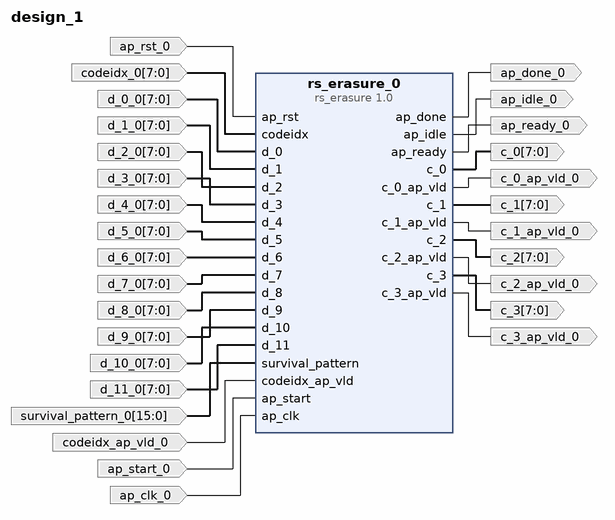
[diagram p0: block diagram of the top level]
# Vivado block design design_1, xc7a35tcpg236-1, Vivado 2018.1
create_bd_design design_1

create_bd_port -dir I -type rst ap_rst_0
set_property -dict {CONFIG.POLARITY ACTIVE_HIGH} [get_bd_ports ap_rst_0]
create_bd_port -dir I -from 7 -to 0 -type data codeidx_0
set_property -dict [list \
  CONFIG.LAYERED_METADATA {xilinx.com:interface:datatypes:1.0 {DATA {datatype {name {attribs {resolve_type immediate dependency {} format string minimum {} maximum {}} value {}} bitwidth {attribs {resolve_type immediate dependency {} format long minimum {} maximum {}} value 8} bitoffset {attribs {resolve_type immediate dependency {} format long minimum {} maximum {}} value 0} integer {signed {attribs {resolve_type immediate dependency {} format bool minimum {} maximum {}} value false}}}}}} \
] [get_bd_ports codeidx_0]
create_bd_port -dir I -from 7 -to 0 -type data d_0_0
set_property -dict [list \
  CONFIG.LAYERED_METADATA {xilinx.com:interface:datatypes:1.0 {DATA {datatype {name {attribs {resolve_type immediate dependency {} format string minimum {} maximum {}} value {}} bitwidth {attribs {resolve_type immediate dependency {} format long minimum {} maximum {}} value 8} bitoffset {attribs {resolve_type immediate dependency {} format long minimum {} maximum {}} value 0} integer {signed {attribs {resolve_type immediate dependency {} format bool minimum {} maximum {}} value false}}}}}} \
] [get_bd_ports d_0_0]
create_bd_port -dir I -from 7 -to 0 -type data d_1_0
set_property -dict [list \
  CONFIG.LAYERED_METADATA {xilinx.com:interface:datatypes:1.0 {DATA {datatype {name {attribs {resolve_type immediate dependency {} format string minimum {} maximum {}} value {}} bitwidth {attribs {resolve_type immediate dependency {} format long minimum {} maximum {}} value 8} bitoffset {attribs {resolve_type immediate dependency {} format long minimum {} maximum {}} value 0} integer {signed {attribs {resolve_type immediate dependency {} format bool minimum {} maximum {}} value false}}}}}} \
] [get_bd_ports d_1_0]
create_bd_port -dir I -from 7 -to 0 -type data d_2_0
set_property -dict [list \
  CONFIG.LAYERED_METADATA {xilinx.com:interface:datatypes:1.0 {DATA {datatype {name {attribs {resolve_type immediate dependency {} format string minimum {} maximum {}} value {}} bitwidth {attribs {resolve_type immediate dependency {} format long minimum {} maximum {}} value 8} bitoffset {attribs {resolve_type immediate dependency {} format long minimum {} maximum {}} value 0} integer {signed {attribs {resolve_type immediate dependency {} format bool minimum {} maximum {}} value false}}}}}} \
] [get_bd_ports d_2_0]
create_bd_port -dir I -from 7 -to 0 -type data d_3_0
set_property -dict [list \
  CONFIG.LAYERED_METADATA {xilinx.com:interface:datatypes:1.0 {DATA {datatype {name {attribs {resolve_type immediate dependency {} format string minimum {} maximum {}} value {}} bitwidth {attribs {resolve_type immediate dependency {} format long minimum {} maximum {}} value 8} bitoffset {attribs {resolve_type immediate dependency {} format long minimum {} maximum {}} value 0} integer {signed {attribs {resolve_type immediate dependency {} format bool minimum {} maximum {}} value false}}}}}} \
] [get_bd_ports d_3_0]
create_bd_port -dir I -from 7 -to 0 -type data d_4_0
set_property -dict [list \
  CONFIG.LAYERED_METADATA {xilinx.com:interface:datatypes:1.0 {DATA {datatype {name {attribs {resolve_type immediate dependency {} format string minimum {} maximum {}} value {}} bitwidth {attribs {resolve_type immediate dependency {} format long minimum {} maximum {}} value 8} bitoffset {attribs {resolve_type immediate dependency {} format long minimum {} maximum {}} value 0} integer {signed {attribs {resolve_type immediate dependency {} format bool minimum {} maximum {}} value false}}}}}} \
] [get_bd_ports d_4_0]
create_bd_port -dir I -from 7 -to 0 -type data d_5_0
set_property -dict [list \
  CONFIG.LAYERED_METADATA {xilinx.com:interface:datatypes:1.0 {DATA {datatype {name {attribs {resolve_type immediate dependency {} format string minimum {} maximum {}} value {}} bitwidth {attribs {resolve_type immediate dependency {} format long minimum {} maximum {}} value 8} bitoffset {attribs {resolve_type immediate dependency {} format long minimum {} maximum {}} value 0} integer {signed {attribs {resolve_type immediate dependency {} format bool minimum {} maximum {}} value false}}}}}} \
] [get_bd_ports d_5_0]
create_bd_port -dir I -from 7 -to 0 -type data d_6_0
set_property -dict [list \
  CONFIG.LAYERED_METADATA {xilinx.com:interface:datatypes:1.0 {DATA {datatype {name {attribs {resolve_type immediate dependency {} format string minimum {} maximum {}} value {}} bitwidth {attribs {resolve_type immediate dependency {} format long minimum {} maximum {}} value 8} bitoffset {attribs {resolve_type immediate dependency {} format long minimum {} maximum {}} value 0} integer {signed {attribs {resolve_type immediate dependency {} format bool minimum {} maximum {}} value false}}}}}} \
] [get_bd_ports d_6_0]
create_bd_port -dir I -from 7 -to 0 -type data d_7_0
set_property -dict [list \
  CONFIG.LAYERED_METADATA {xilinx.com:interface:datatypes:1.0 {DATA {datatype {name {attribs {resolve_type immediate dependency {} format string minimum {} maximum {}} value {}} bitwidth {attribs {resolve_type immediate dependency {} format long minimum {} maximum {}} value 8} bitoffset {attribs {resolve_type immediate dependency {} format long minimum {} maximum {}} value 0} integer {signed {attribs {resolve_type immediate dependency {} format bool minimum {} maximum {}} value false}}}}}} \
] [get_bd_ports d_7_0]
create_bd_port -dir I -from 7 -to 0 -type data d_8_0
set_property -dict [list \
  CONFIG.LAYERED_METADATA {xilinx.com:interface:datatypes:1.0 {DATA {datatype {name {attribs {resolve_type immediate dependency {} format string minimum {} maximum {}} value {}} bitwidth {attribs {resolve_type immediate dependency {} format long minimum {} maximum {}} value 8} bitoffset {attribs {resolve_type immediate dependency {} format long minimum {} maximum {}} value 0} integer {signed {attribs {resolve_type immediate dependency {} format bool minimum {} maximum {}} value false}}}}}} \
] [get_bd_ports d_8_0]
create_bd_port -dir I -from 7 -to 0 -type data d_9_0
set_property -dict [list \
  CONFIG.LAYERED_METADATA {xilinx.com:interface:datatypes:1.0 {DATA {datatype {name {attribs {resolve_type immediate dependency {} format string minimum {} maximum {}} value {}} bitwidth {attribs {resolve_type immediate dependency {} format long minimum {} maximum {}} value 8} bitoffset {attribs {resolve_type immediate dependency {} format long minimum {} maximum {}} value 0} integer {signed {attribs {resolve_type immediate dependency {} format bool minimum {} maximum {}} value false}}}}}} \
] [get_bd_ports d_9_0]
create_bd_port -dir I -from 7 -to 0 -type data d_10_0
set_property -dict [list \
  CONFIG.LAYERED_METADATA {xilinx.com:interface:datatypes:1.0 {DATA {datatype {name {attribs {resolve_type immediate dependency {} format string minimum {} maximum {}} value {}} bitwidth {attribs {resolve_type immediate dependency {} format long minimum {} maximum {}} value 8} bitoffset {attribs {resolve_type immediate dependency {} format long minimum {} maximum {}} value 0} integer {signed {attribs {resolve_type immediate dependency {} format bool minimum {} maximum {}} value false}}}}}} \
] [get_bd_ports d_10_0]
create_bd_port -dir I -from 7 -to 0 -type data d_11_0
set_property -dict [list \
  CONFIG.LAYERED_METADATA {xilinx.com:interface:datatypes:1.0 {DATA {datatype {name {attribs {resolve_type immediate dependency {} format string minimum {} maximum {}} value {}} bitwidth {attribs {resolve_type immediate dependency {} format long minimum {} maximum {}} value 8} bitoffset {attribs {resolve_type immediate dependency {} format long minimum {} maximum {}} value 0} integer {signed {attribs {resolve_type immediate dependency {} format bool minimum {} maximum {}} value false}}}}}} \
] [get_bd_ports d_11_0]
create_bd_port -dir I -from 15 -to 0 -type data survival_pattern_0
set_property -dict [list \
  CONFIG.LAYERED_METADATA {xilinx.com:interface:datatypes:1.0 {DATA {datatype {name {attribs {resolve_type immediate dependency {} format string minimum {} maximum {}} value {}} bitwidth {attribs {resolve_type immediate dependency {} format long minimum {} maximum {}} value 16} bitoffset {attribs {resolve_type immediate dependency {} format long minimum {} maximum {}} value 0} integer {signed {attribs {resolve_type immediate dependency {} format bool minimum {} maximum {}} value false}}}}}} \
] [get_bd_ports survival_pattern_0]
create_bd_port -dir I codeidx_ap_vld_0
create_bd_port -dir O c_0_ap_vld_0
create_bd_port -dir O c_1_ap_vld_0
create_bd_port -dir O c_2_ap_vld_0
create_bd_port -dir O c_3_ap_vld_0
create_bd_port -dir O -from 7 -to 0 -type data c_0
create_bd_port -dir O -from 7 -to 0 -type data c_1
create_bd_port -dir O -from 7 -to 0 -type data c_2
create_bd_port -dir O -from 7 -to 0 -type data c_3
create_bd_port -dir I ap_start_0
create_bd_port -dir O ap_done_0
create_bd_port -dir O ap_idle_0
create_bd_port -dir O ap_ready_0
create_bd_port -dir I -type clk ap_clk_0

create_bd_cell -type ip -vlnv xilinx.com:hls:rs_erasure:1.0 rs_erasure_0

# ---- connections ----

connect_bd_net -net ap_rst_0_1 [get_bd_ports ap_rst_0] [get_bd_pins rs_erasure_0/ap_rst]
connect_bd_net -net codeidx_0_1 [get_bd_ports codeidx_0] [get_bd_pins rs_erasure_0/codeidx]
connect_bd_net -net d_0_0_1 [get_bd_ports d_0_0] [get_bd_pins rs_erasure_0/d_0]
connect_bd_net -net d_1_0_1 [get_bd_ports d_1_0] [get_bd_pins rs_erasure_0/d_1]
connect_bd_net -net d_2_0_1 [get_bd_ports d_2_0] [get_bd_pins rs_erasure_0/d_2]
connect_bd_net -net d_3_0_1 [get_bd_ports d_3_0] [get_bd_pins rs_erasure_0/d_3]
connect_bd_net -net d_4_0_1 [get_bd_ports d_4_0] [get_bd_pins rs_erasure_0/d_4]
connect_bd_net -net d_5_0_1 [get_bd_ports d_5_0] [get_bd_pins rs_erasure_0/d_5]
connect_bd_net -net d_6_0_1 [get_bd_ports d_6_0] [get_bd_pins rs_erasure_0/d_6]
connect_bd_net -net d_7_0_1 [get_bd_ports d_7_0] [get_bd_pins rs_erasure_0/d_7]
connect_bd_net -net d_8_0_1 [get_bd_ports d_8_0] [get_bd_pins rs_erasure_0/d_8]
connect_bd_net -net d_9_0_1 [get_bd_ports d_9_0] [get_bd_pins rs_erasure_0/d_9]
connect_bd_net -net d_10_0_1 [get_bd_ports d_10_0] [get_bd_pins rs_erasure_0/d_10]
connect_bd_net -net d_11_0_1 [get_bd_ports d_11_0] [get_bd_pins rs_erasure_0/d_11]
connect_bd_net -net survival_pattern_0_1 [get_bd_ports survival_pattern_0] [get_bd_pins rs_erasure_0/survival_pattern]
connect_bd_net -net codeidx_ap_vld_0_1 [get_bd_ports codeidx_ap_vld_0] [get_bd_pins rs_erasure_0/codeidx_ap_vld]
connect_bd_net [get_bd_pins rs_erasure_0/c_0_ap_vld] [get_bd_ports c_0_ap_vld_0]
connect_bd_net [get_bd_pins rs_erasure_0/c_1_ap_vld] [get_bd_ports c_1_ap_vld_0]
connect_bd_net [get_bd_pins rs_erasure_0/c_2_ap_vld] [get_bd_ports c_2_ap_vld_0]
connect_bd_net [get_bd_pins rs_erasure_0/c_3_ap_vld] [get_bd_ports c_3_ap_vld_0]
connect_bd_net [get_bd_pins rs_erasure_0/c_0] [get_bd_ports c_0]
connect_bd_net [get_bd_pins rs_erasure_0/c_1] [get_bd_ports c_1]
connect_bd_net [get_bd_pins rs_erasure_0/c_2] [get_bd_ports c_2]
connect_bd_net [get_bd_pins rs_erasure_0/c_3] [get_bd_ports c_3]
connect_bd_net -net ap_start_0_1 [get_bd_ports ap_start_0] [get_bd_pins rs_erasure_0/ap_start]
connect_bd_net [get_bd_pins rs_erasure_0/ap_done] [get_bd_ports ap_done_0]
connect_bd_net [get_bd_pins rs_erasure_0/ap_idle] [get_bd_ports ap_idle_0]
connect_bd_net [get_bd_pins rs_erasure_0/ap_ready] [get_bd_ports ap_ready_0]
connect_bd_net -net ap_clk_0_1 [get_bd_ports ap_clk_0] [get_bd_pins rs_erasure_0/ap_clk]

validate_bd_design
save_bd_design
